# Altium schematic sheet MCU.SchDoc
size A4; SheetNumber: 6; SheetTotal: 10
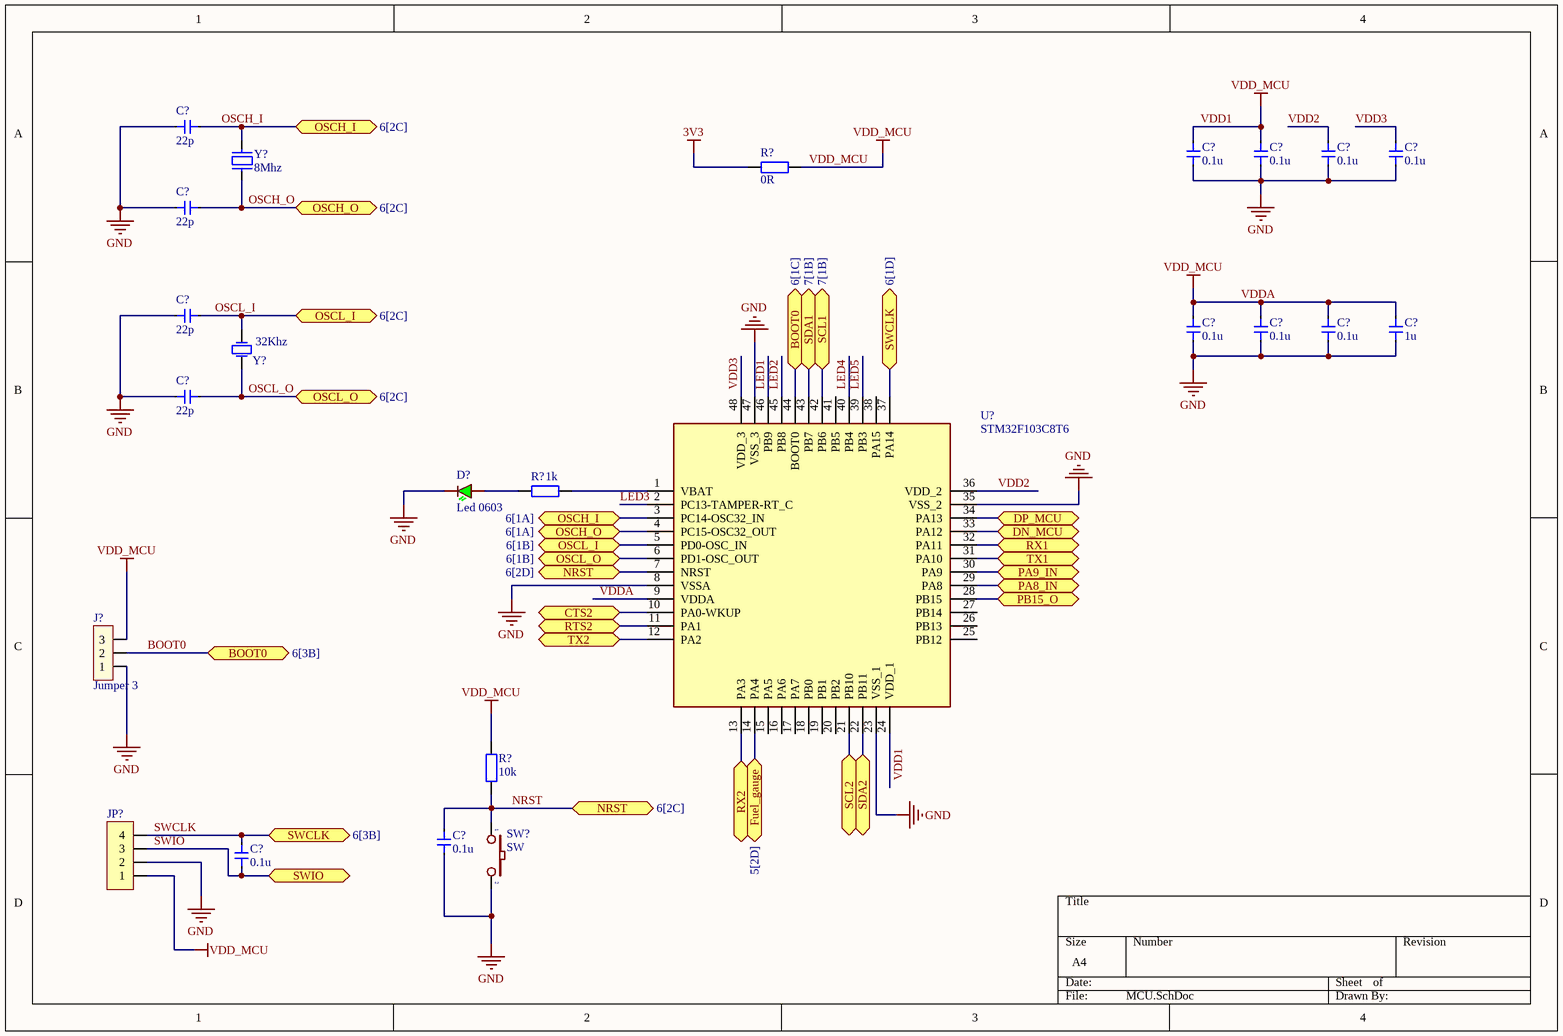
[diagram p0: MCU.SchDoc]

## Parts
(Parts that share a designator on the sheet are numbered #1, #2 ... from top to bottom, then left to right.)
C?#1  22p  [Cap 0603]
C?#2  0.1u  [Cap 0603]
C?#3  0.1u  [Cap 0603]
C?#4  0.1u  [Cap 0603]
C?#5  0.1u  [Cap 0603]
C?#6  22p  [Cap 0603]
C?#7  22p  [Cap 0603]
C?#8  0.1u  [Cap 0603]
C?#9  0.1u  [Cap 0603]
C?#10  0.1u  [Cap 0603]
C?#11  1u  [Cap 0603]
C?#12  22p  [Cap 0603]
C?#13  0.1u  [Cap 0603]
C?#14  0.1u  [Cap 0603]
D?  Led 0603  [LED 0603]
J?  Jumper 3  [JP3]
JP?  JP 1x4 2.54  [JP 1x4 DT]  (value not drawn)
R?#1  0R  [tro smd 0603]
R?#2  1k  [tro smd 0603]
R?#3  10k  [tro smd 0603]
SW?  SW  [SW2]
U?  STM32F103C8T6  [LQFP-48_19.6_393_58X11_SMD]
Y?#1  8Mhz  [Thach Anh 2 chan SMD5032]
Y?#2  32Khz  [THACH ANH DAN 3215]

## Ports
BOOT0 (bidir, see 6[1C]), BOOT0 (bidir, see 6[3B]), CTS2 (bidir), DN_MCU (bidir), DP_MCU (bidir), Fuel_gauge (bidir, see 5[2D]), NRST (bidir, see 6[2C]), NRST (bidir, see 6[2D]), OSCH_I (bidir, see 6[1A]), OSCH_I (bidir, see 6[2C]), OSCH_O (bidir, see 6[1A]), OSCH_O (bidir, see 6[2C]), OSCL_I (bidir, see 6[1B]), OSCL_I (bidir, see 6[2C]), OSCL_O (bidir, see 6[1B]), OSCL_O (bidir, see 6[2C]), PA8_IN (bidir), PA9_IN (bidir), PB15_O (bidir), RTS2 (bidir), RX1 (bidir), RX2 (bidir), SCL1 (bidir, see 7[1B]), SCL2 (bidir), SDA1 (bidir, see 7[1B]), SDA2 (bidir), SWCLK (bidir, see 6[1D]), SWCLK (bidir, see 6[3B]), SWIO (bidir), TX1 (bidir), TX2 (bidir)

## Nets
3V3: R?#1.1
GND: C?#1.1 C?#2.2 C?#3.2 C?#4.2 C?#5.2 C?#6.1 C?#7.1 C?#8.2 C?#9.2 C?#10.2 C?#11.2 C?#12.1 C?#13.2 D?.2 J?.1 JP?.2 SW?.2 U?.8(VSSA) U?.23(VSS_1) U?.35(VSS_2) U?.47(VSS_3)
VDD1: C?#2.1 C?#3.1 C?#8.1 C?#9.1 C?#10.1 C?#11.1 J?.3 JP?.1 R?#1.2 R?#3.2 U?.9(VDDA) U?.24(VDD_1)  [also labelled VDD_MCU, VDDA]
BOOT0: J?.2 U?.44(BOOT0) ; port BOOT0
CTS2: U?.10(PA0-WKUP) ; port CTS2
DN_MCU: U?.33(PA12) ; port DN_MCU
DP_MCU: U?.34(PA13) ; port DP_MCU
Fuel_gauge: U?.14(PA4) ; port Fuel_gauge
LED1: U?.46(PB9)
LED2: U?.45(PB8)
LED3: U?.2(PC13-TAMPER-RT_C)
LED4: U?.40(PB4)
LED5: U?.39(PB3)
NRST: C?#13.1 R?#3.1 SW?.1 U?.7(NRST) ; port NRST
OSCH_I: C?#1.2 U?.3(PC14-OSC32_IN) Y?#1.2 ; port OSCH_I
OSCH_O: C?#6.2 U?.4(PC15-OSC32_OUT) Y?#1.1 ; port OSCH_O
OSCL_I: C?#7.2 U?.5(PD0-OSC_IN) Y?#2.2(OSC2) ; port OSCL_I
OSCL_O: C?#12.2 U?.6(PD1-OSC_OUT) Y?#2.1(OSC1) ; port OSCL_O
PA8_IN: U?.29(PA8) ; port PA8_IN
PA9_IN: U?.30(PA9) ; port PA9_IN
PB15_O: U?.28(PB15) ; port PB15_O
RTS2: U?.11(PA1) ; port RTS2
RX1: U?.32(PA11) ; port RX1
RX2: U?.13(PA3) ; port RX2
SCL1: U?.42(PB6) ; port SCL1
SCL2: U?.21(PB10) ; port SCL2
SDA1: U?.43(PB7) ; port SDA1
SDA2: U?.22(PB11) ; port SDA2
SWCLK: C?#14.1 JP?.4 U?.37(PA14) ; port SWCLK
SWIO: C?#14.2 JP?.3 ; port SWIO
TX1: U?.31(PA10) ; port TX1
TX2: U?.12(PA2) ; port TX2
VDD2: C?#4.1 U?.36(VDD_2)
VDD3: C?#5.1 U?.48(VDD_3)
NetD?_1: D?.1 R?#2.2
NetR?#2_1: R?#2.1 U?.1(VBAT)

Not connected (* = marked no-connect by the designer): U? 15(PA5) 16(PA6) 17(PA7) 18(PB0) 19(PB1) 20(PB2) 25(PB12) 26(PB13) 27(PB14) 38(PA15) 41(PB5)

## Library data of the parts
C?#1-C?#14 = Cap 0603: Capacitor SMD 0603
J? = JP3: Value: J3
JP? = JP 1x4 2.54 Duc Thang: Cắm; Ten_Linh_Kien: Jump Đơn Đực 2.54MM 1x40P Thẳng 11MM; Don_Vi: Con; Ma_Hang: MH000903; Ghi_Chu: *; Kieu_Chan: *; Chung_Loai: Cắm
R?#1-R?#3 = Tro 0603 1% 10k: Dán; Don_Vi: Con; So_Chan: 2; Ten_Linh_Kien: Trở 0603 1% 10k; Ma_Hang: MH006333; Chung_Loai: Dán; Kieu_Chan: *
SW? = SW2: Switch button 2 pin; Value: SW chip 2 pin
U? = IC_STM32F103C8T6: ARM® Cortex®-M3 STM32F1 Microcontroller IC 32-Bit 72MHz 64KB (64K x 8) FLASH 48-LQFP (7x7); Manufacturer: STMicroelectronics; Alternate Part Number-1: NA; Manufacturer Part Number: STM32F103C8T6; Case/Package: LQFP48; Supplier-1: LCSC; Supplier Part Number-1: STM32F103C8T6
Y?#1 = Thach Anh 2 chan SMD 5032: Crystal For all Crystal 2pin.; Value: 4Mhz
Y?#2 = Thach Anh SMD 3225: C700805; Chung_Loai: Dán; Ten_Linh_Kien: Thạch Anh 16Mhz SMD5032; Ma_Hang: MH001979; Don_Vi: Con; Ghi_Chu: *; Kieu_Chan: *